# Altium schematic sheet eye.SchDoc: Light & Mic
size A4; Organization: GPA Robotics; DocumentNumber: 2; Revision: REV 0; SheetNumber: 2; SheetTotal: 2
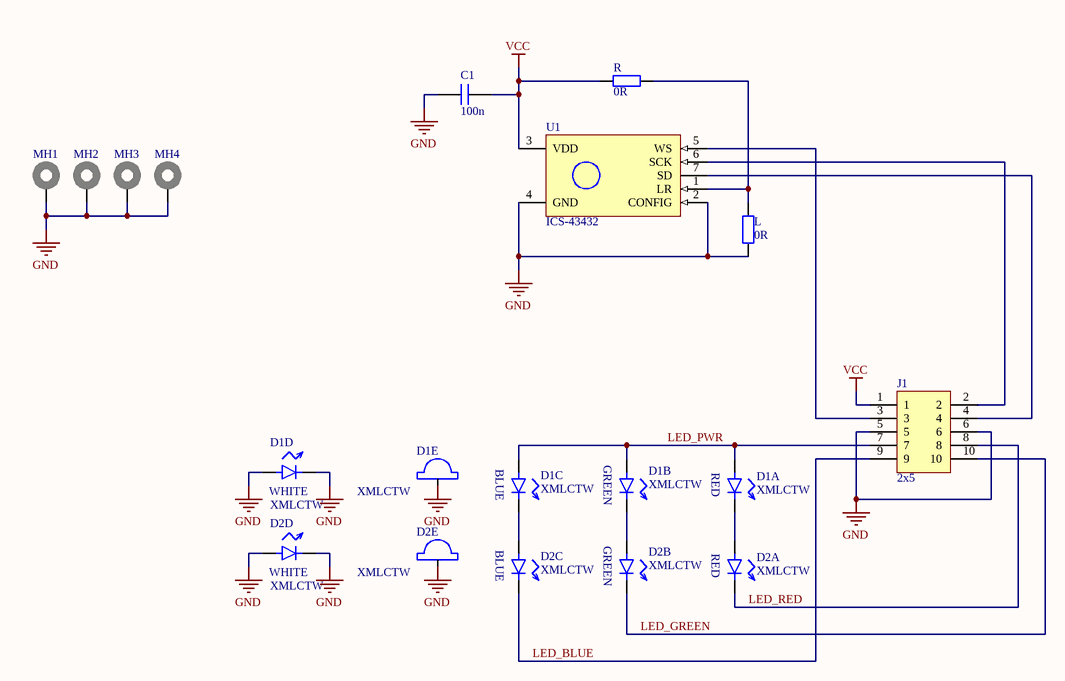
[diagram p0: eye.SchDoc]

## Parts
C1  value 100n  [CAPC1005X06N]  (hidden comment: cap)
D1  XMLCTW  [PSON125P500X302_HS-9N]  (parts A,B,C,D,E of 5)
D2  XMLCTW  [PSON125P500X302_HS-9N]  (parts A,B,C,D,E of 5)
J1  2x5  [hdr_2x5_50mil]
L  value 0R  [RESC1005X04N]  (hidden comment: res)
MH1  ID2.25x2.5mm  [9774025943]  (value not drawn)
MH2  ID2.25x2.5mm  [9774025943]  (value not drawn)
MH3  ID2.25x2.5mm  [9774025943]  (value not drawn)
MH4  ID2.25x2.5mm  [9774025943]  (value not drawn)
R  value 0R  [RESC1005X04N]  (hidden comment: res)
U1  ICS-43432  [PSON65P300X110-6N]

## Nets
GND: C1.1 D1.9(PAD) D1.WA D1.WC D2.9(PAD) D2.WA D2.WC J1.5 J1.6 L.1 MH1.1 MH2.1 MH3.1 MH4.1 U1.2(CONFIG) U1.4(GND)
VCC: C1.2 J1.1 R.2 U1.3(VDD)
LED_BLUE: D2.BC J1.9
LED_GREEN: D2.GC J1.10
LED_PWR: D1.BA D1.GA D1.RA J1.7
LED_RED: D2.RC J1.8
NetD1_BC: D1.BC D2.BA
NetD1_GC: D1.GC D2.GA
NetD1_RC: D1.RC D2.RA
NetJ1_2: J1.2 U1.6(SCK)
NetJ1_3: J1.3 U1.5(WS)
NetJ1_4: J1.4 U1.7(SD)
NetL_2: L.2 R.1 U1.1(LR)

## Notes on the sheet
- Title
- Size:
- Date:
- A4
- Number:
- Time:
- Revision:
- Sheet
- of
- Repo:
- (in symbol xmlctw, part A) RED
- (in symbol xmlctw, part B) GREEN
- (in symbol xmlctw, part C) BLUE
- (in symbol xmlctw, part D) WHITE

## Library data of the parts
C1 = cap: Capacitor; Supplier 1: Digi-Key; Supplier Part Number 1: 1276-1002-1-ND
J1 = hdr_2x5: 2x5 Header; Supplier 1: Digi-Key; Supplier Part Number 1: SAM8796-ND
L R = res: Resistor; Supplier 1: Digi-Key; Supplier Part Number 1: RMCF0402ZT0R00CT-ND
MH1-MH4 = 9774025943R: WA-SMST SMT Steel Spacer non stop, OD4.35mm, ID2.25x2.5mm; Inner Diameter: 2.25mm; Outer Diameter: 4.35mm; Surface: Tin; ComponentLink1Description: Manufacturer; ComponentLink1URL: http://www.we-online.de; ComponentLink2Description: Datasheet; ComponentLink2URL: https://katalog.we-online.com/em/datasheet/9774025943R.pdf; Operating Temperature: -55 to +150degC; Part Number: 9774025943R; Published Date: September 2019; Material: Steel; Length: 2.5mm; Packaging: Tape and Reel; Publisher: Wurth Elektronik; Mounting Technology: SMT; Supplier 1: Digi-Key; Supplier Part Number 1: 732-10939-1-ND
D1 D2 = xmlctw: Supplier 1: Digi-Key; Supplier Part Number 1: XMLCTW-A2-0000-00C2AAAB1CT-ND
U1 = ics-43432: Supplier 1: Digi-Key; Supplier Part Number 1: 1428-1053-1-ND